# Altium schematic sheet usb_program_circuit.SchDoc
size A4; SheetNumber: 8; SheetTotal: 13
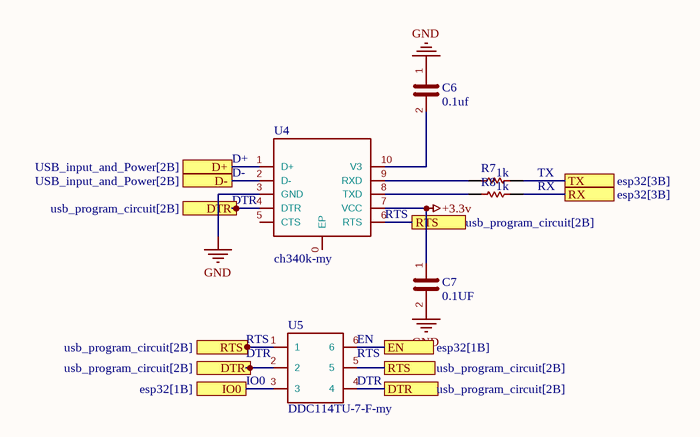
[diagram p0: usb_program_circuit.SchDoc]

## Parts
C6  0.1uf  [CAPC2013X70X45NL10T25]
C7  0.1UF  [CAPC2013X70X45NL10T25]
R7  1k  [RESC2013X70X40NL20T20]
R8  1k  [RESC2013X70X40NL20T20]
U4  ch340k-my  [SOP100P600X160-11N]
U5  DDC114TU-7-F-my  [DDC114TU-7-F]

## Ports
D+ (see USB_input_and_Power[2B]), D- (see USB_input_and_Power[2B]), DTR (see usb_program_circuit[2B]), EN (see esp32[1B]), IO0 (see esp32[1B]), RTS (see usb_program_circuit[2B]), RX (see esp32[3B]), TX (see esp32[3B])

## Nets
+3.3v: C7.1 U4.7(VCC)
GND: C6.1 C7.2 U4.3(GND)
D+: U4.1(D+) ; port D+
D-: U4.2(D-) ; port D-
DTR: U4.4(DTR) U5.2 U5.4 ; port DTR
EN: U5.6 ; port EN
IO0: U5.3 ; port IO0
RTS: U4.6(RTS) U5.1 U5.5 ; port RTS
RX: R8.1 ; port RX
TX: R7.1 ; port TX
NetC6_2: C6.2 U4.10(V3)
NetR7_2: R7.2 U4.9(RXD)
NetR8_2: R8.2 U4.8(TXD)

Not connected (* = marked no-connect by the designer): U4 0(EP) 5(CTS)

## Notes on the sheet
- (near U4) D+
- (near U4) D-
- TX
- RX
- (near U4) DTR
- (near U4) RTS
- (near U5) RTS
- (near U5) DTR
- (near U5) IO0
- (near U5) EN

## Library data of the parts
C6 C7 = C
R7 R8 = CMP-2100-03671-1: Chip Resistor, 1 KOhm, +/- 1%, 125 mW, -55 to 155 degC, 0805 (2012 Metric), RoHS, Tape and Reel; Manufacturer: Yageo; Temperature Coefficient: 100ppm/degreesC; Voltage Rating (DC): 150V; Max Power Dissipation: 125mW; Resistance: 1KOhm; Number of Pins: 2; Number of Terminations: 2; Datasheet URL: http://www.yageo.com/NewPortal/yageodocoutput?fileName=/pdf/R-Chip/PYu-RC_Group_51_RoHS_L_5.pdf; Length: 0.079inch; Package Description: 2-Pin Surface Mounted Device, Body 2 x 1.25 mm; Depth: 1.25mm; Height: 0.024inch; Military Standard: Not; Case/Package: 0805; Package Reference: 0805; RoHSCompliant: true; Lead Free: LeadFree; Packaging: TapeandReel; Package Quantity: 1; Datasheet Version: Rev. 5, 10/2016; Tolerance: 1%; Min Operating Temperature: -55degC; Voltage Rating: 150V; Composition: ThickFilm; Case Code (Imperial): 0805; Power Rating: 125mW; Width: 0.049inch; Case Code (Metric): 2012; Manufacturer URL: http://www.yageo.com/; Max Operating Temperature: 155degC; REACH SVHC: Unknown; Termination: SMD/SMT